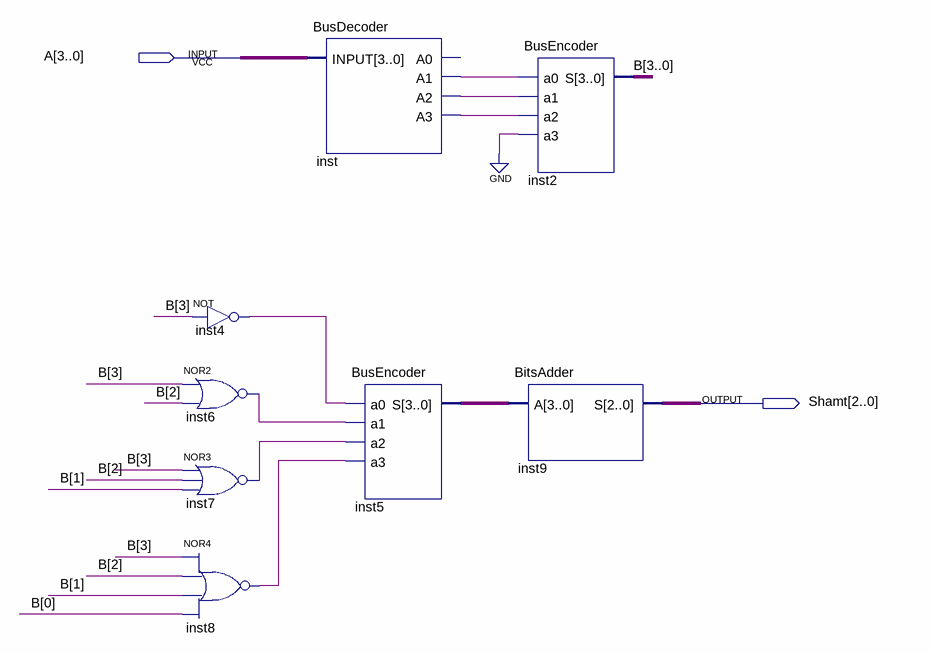
[diagram p0: schematic sheet]
// Quartus schematic FindShiftAmount.bdf as structural Verilog: 8 symbols, 2 pins
module FindShiftAmount (
  input  [3:0] A,
  output [2:0] Shamt
);

  wire inst4_out, inst6_out, inst7_out, inst8_out, inst_a1, inst_a2, inst_a3;
  wire [3:0] B, inst5_s;

  not inst4 (inst4_out, B[3]);
  nor inst6 (inst6_out, B[3], B[2]);
  nor inst7 (inst7_out, B[3], B[2], B[1]);
  nor inst8 (inst8_out, B[3], B[2], B[1], B[0]);
  BusDecoder inst (.INPUT(A), .A1(inst_a1), .A2(inst_a2), .A3(inst_a3));  // open: A0
  BusEncoder inst5 (.a0(inst4_out), .a1(inst6_out), .a2(inst7_out), .a3(inst8_out), .S(inst5_s));
  BusEncoder inst2 (.a0(inst_a1), .a1(inst_a2), .a2(inst_a3), .a3(1'b0), .S(B));
  BitsAdder inst9 (.A(inst5_s), .S(Shamt));
endmodule
